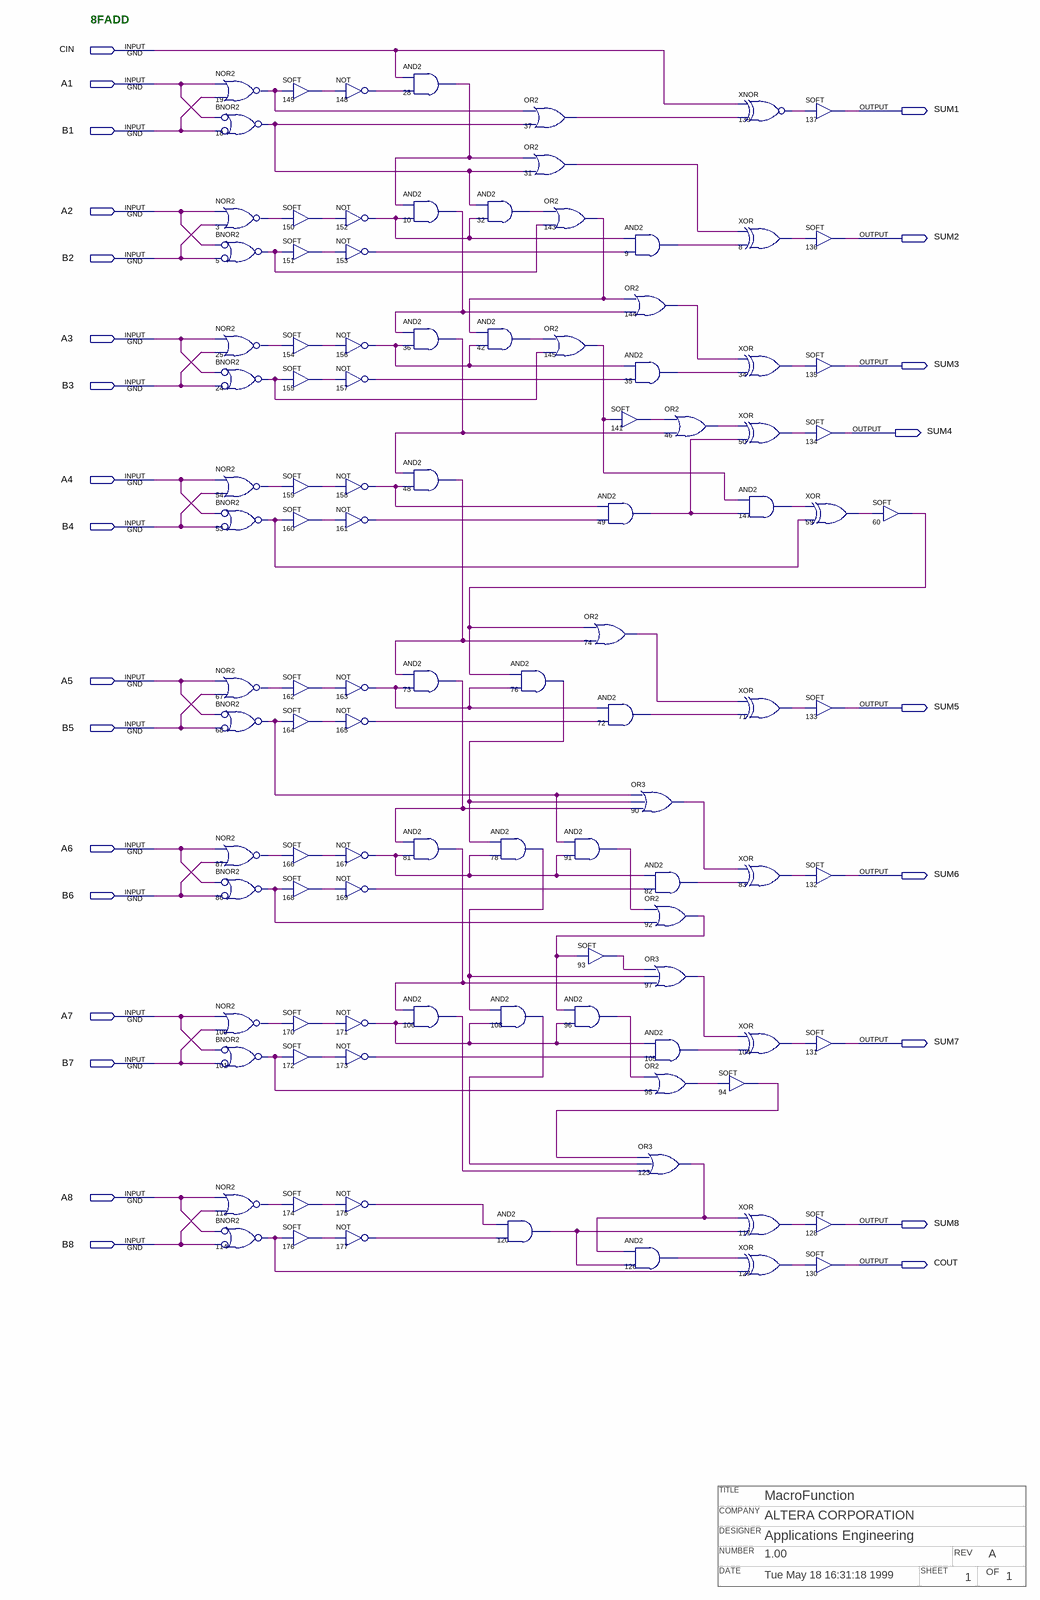
[diagram p0: schematic sheet]
// Quartus schematic p8fadd.bdf as structural Verilog: 104 symbols, 26 pins
// Title block: TITLE: MacroFunction; COMPANY: ALTERA CORPORATION; DESIGNER: Applications Engineering; NUMBER: 1.00; REV: A; DATE: Tue May 18 16:31:18 1999; SHEET: 1; OF: 1
module p8fadd (
  input  CIN,
  input  A1,
  input  B1,
  input  A2,
  input  B2,
  input  A3,
  input  B3,
  input  A4,
  input  B4,
  input  A5,
  input  B5,
  input  A6,
  input  B6,
  input  A7,
  input  B7,
  input  A8,
  input  B8,
  output SUM1,
  output SUM2,
  output SUM3,
  output SUM4,
  output SUM5,
  output SUM6,
  output SUM7,
  output SUM8,
  output COUT
);

  wire n3_out, n5_out, n8_out, n9_out, n10_out, n18_out, n19_out, n24_out, n25_out, n28_out, n31_out,
       n32_out, n34_out, n35_out, n36_out, n37_out, n42_out, n46_out, n48_out, n49_out, n50_out, n53_out,
       n54_out, n59_out, n60_out, n67_out, n68_out, n71_out, n72_out, n73_out, n74_out, n76_out, n78_out,
       n81_out, n82_out, n83_out, n86_out, n87_out, n90_out, n91_out, n92_out, n93_out, n94_out, n95_out,
       n96_out, n97_out, n100_out, n101_out, n104_out, n105_out, n106_out, n108_out, n113_out, n114_out,
       n117_out, n120_out, n123_out, n126_out, n127_out, n139_out, n141_out, n143_out, n144_out, n145_out,
       n147_out, n148_out, n149_out, n150_out, n151_out, n152_out, n153_out, n154_out, n155_out, n156_out,
       n157_out, n158_out, n159_out, n160_out, n161_out, n162_out, n163_out, n164_out, n165_out, n166_out,
       n167_out, n168_out, n169_out, n170_out, n171_out, n172_out, n173_out, n174_out, n175_out, n176_out,
       n177_out;

  nor u_19 (n19_out, A1, B1);
  nor u_18 (n18_out, ~A1, ~B1);  // BNOR2
  nor u_3 (n3_out, A2, B2);
  nor u_5 (n5_out, ~A2, ~B2);  // BNOR2
  nor u_25 (n25_out, A3, B3);
  nor u_24 (n24_out, ~A3, ~B3);  // BNOR2
  nor u_54 (n54_out, A4, B4);
  nor u_53 (n53_out, ~A4, ~B4);  // BNOR2
  nor u_67 (n67_out, A5, B5);
  nor u_68 (n68_out, ~A5, ~B5);  // BNOR2
  nor u_87 (n87_out, A6, B6);
  nor u_86 (n86_out, ~A6, ~B6);  // BNOR2
  nor u_100 (n100_out, A7, B7);
  nor u_101 (n101_out, ~A7, ~B7);  // BNOR2
  nor u_113 (n113_out, A8, B8);
  nor u_114 (n114_out, ~A8, ~B8);  // BNOR2
  SOFT u_149 (.IN(n19_out), .OUT(n149_out));
  SOFT u_150 (.IN(n3_out), .OUT(n150_out));
  SOFT u_151 (.IN(n5_out), .OUT(n151_out));
  SOFT u_154 (.IN(n25_out), .OUT(n154_out));
  SOFT u_155 (.IN(n24_out), .OUT(n155_out));
  SOFT u_159 (.IN(n54_out), .OUT(n159_out));
  SOFT u_160 (.IN(n53_out), .OUT(n160_out));
  SOFT u_162 (.IN(n67_out), .OUT(n162_out));
  SOFT u_164 (.IN(n68_out), .OUT(n164_out));
  SOFT u_166 (.IN(n87_out), .OUT(n166_out));
  SOFT u_168 (.IN(n86_out), .OUT(n168_out));
  SOFT u_170 (.IN(n100_out), .OUT(n170_out));
  SOFT u_172 (.IN(n101_out), .OUT(n172_out));
  SOFT u_174 (.IN(n113_out), .OUT(n174_out));
  SOFT u_176 (.IN(n114_out), .OUT(n176_out));
  not u_148 (n148_out, n149_out);
  not u_152 (n152_out, n150_out);
  not u_153 (n153_out, n151_out);
  not u_156 (n156_out, n154_out);
  not u_157 (n157_out, n155_out);
  not u_158 (n158_out, n159_out);
  not u_161 (n161_out, n160_out);
  not u_163 (n163_out, n162_out);
  not u_165 (n165_out, n164_out);
  not u_167 (n167_out, n166_out);
  not u_169 (n169_out, n168_out);
  not u_171 (n171_out, n170_out);
  not u_173 (n173_out, n172_out);
  not u_175 (n175_out, n174_out);
  not u_177 (n177_out, n176_out);
  and u_28 (n28_out, CIN, n148_out);
  and u_10 (n10_out, n28_out, n152_out);
  and u_36 (n36_out, n10_out, n156_out);
  and u_48 (n48_out, n36_out, n158_out);
  and u_73 (n73_out, n48_out, n163_out);
  and u_81 (n81_out, n73_out, n167_out);
  and u_106 (n106_out, n81_out, n171_out);
  and u_32 (n32_out, n18_out, n152_out);
  and u_42 (n42_out, n143_out, n156_out);
  or u_37 (n37_out, n19_out, n18_out);
  or u_31 (n31_out, n28_out, n18_out);
  and u_76 (n76_out, n60_out, n163_out);
  and u_78 (n78_out, n76_out, n167_out);
  and u_108 (n108_out, n78_out, n171_out);
  and u_120 (n120_out, n175_out, n177_out);
  or u_143 (n143_out, n32_out, n5_out);
  or u_145 (n145_out, n42_out, n24_out);
  or u_74 (n74_out, n60_out, n48_out);
  and u_91 (n91_out, n68_out, n167_out);
  SOFT u_93 (.IN(n92_out), .OUT(n93_out));
  and u_96 (n96_out, n92_out, n171_out);
  and u_9 (n9_out, n152_out, n153_out);
  or u_144 (n144_out, n143_out, n10_out);
  and u_35 (n35_out, n156_out, n157_out);
  SOFT u_141 (.IN(n145_out), .OUT(n141_out));
  and u_49 (n49_out, n158_out, n161_out);
  and u_72 (n72_out, n163_out, n165_out);
  or u_90 (n90_out, n68_out, n76_out, n73_out);
  or u_123 (n123_out, n94_out, n108_out, n106_out);
  and u_126 (n126_out, n123_out, n120_out);
  or u_46 (n46_out, n141_out, n36_out);
  and u_82 (n82_out, n167_out, n169_out);
  or u_92 (n92_out, n91_out, n86_out);
  or u_97 (n97_out, n93_out, n78_out, n81_out);
  and u_105 (n105_out, n171_out, n173_out);
  or u_95 (n95_out, n96_out, n101_out);
  xnor u_139 (n139_out, CIN, n37_out);
  xor u_8 (n8_out, n31_out, n9_out);
  xor u_34 (n34_out, n144_out, n35_out);
  xor u_50 (n50_out, n46_out, n49_out);
  and u_147 (n147_out, n145_out, n49_out);
  xor u_71 (n71_out, n74_out, n72_out);
  xor u_83 (n83_out, n90_out, n82_out);
  xor u_104 (n104_out, n97_out, n105_out);
  SOFT u_94 (.IN(n95_out), .OUT(n94_out));
  xor u_117 (n117_out, n123_out, n120_out);
  xor u_127 (n127_out, n126_out, n114_out);
  SOFT u_137 (.IN(n139_out), .OUT(SUM1));
  SOFT u_136 (.IN(n8_out), .OUT(SUM2));
  SOFT u_135 (.IN(n34_out), .OUT(SUM3));
  SOFT u_134 (.IN(n50_out), .OUT(SUM4));
  xor u_59 (n59_out, n147_out, n53_out);
  SOFT u_133 (.IN(n71_out), .OUT(SUM5));
  SOFT u_132 (.IN(n83_out), .OUT(SUM6));
  SOFT u_131 (.IN(n104_out), .OUT(SUM7));
  SOFT u_128 (.IN(n117_out), .OUT(SUM8));
  SOFT u_130 (.IN(n127_out), .OUT(COUT));
  SOFT u_60 (.IN(n59_out), .OUT(n60_out));

  // Notes on the sheet:
  //   8FADD
endmodule
